# Altium project new edr.PrjPcb
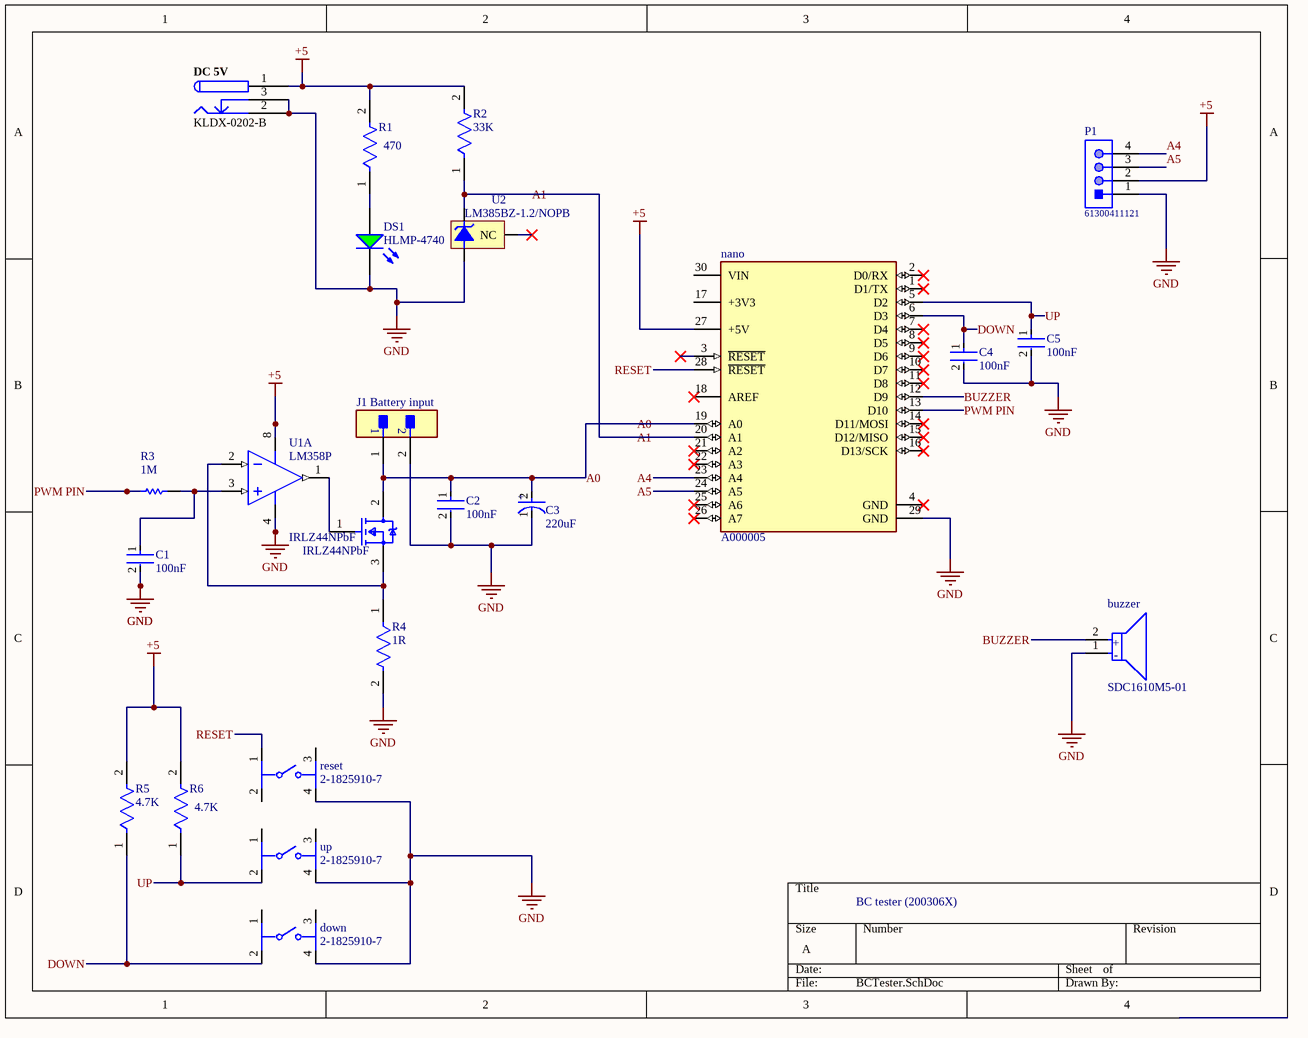
[diagram p0: BCTester.SchDoc]
1 sheet, 23 parts. Net scope: global (net labels, ports and power ports of the same name join across sheets).
Board file: PCB1.PcbDoc

## Sheet BCTester.SchDoc
size A; SheetNumber: 1; SheetTotal: 1; SPICEModelCacheEEAPYXYC: <root> / <DocumentId>EEAPYXYC</DocumentId> / </root>

### Parts
buzzer  SDC1610M5-01  [FP-SDC1610M5-01-MFG]
C1  100nF  [FP-DE6_D7_T7_F7_5_d0_6-0-MFG]
C2  100nF  [FP-DE6_D7_T7_F7_5_d0_6-0-MFG]
C3  220uF  [FP-RAD-TH-D_8_0_5-L_11_5-MFG]
C4  100nF  [FP-DE6_D7_T7_F7_5_d0_6-0-MFG]
C5  100nF  [FP-DE6_D7_T7_F7_5_d0_6-0-MFG]
DC_5V  KLDX-0202-B  [KYCN-KLDX-0202-B_V]
down  2-1825910-7  [FP-2-1825910-7-MFG]
DS1  HLMP-4740  [AVAG-HLMP-4740]
IRLZ44NPbF  IRLZ44NPbF  [FP-PG-TO220-3-MFG]
J1  Battery input  [FP-M20-9990246-MFG]
nano  A000005  [FP-A000005-MFG]
P1  61300411121  [61300411121]
R1  470  [FP-RNC55-MFG]
R2  33K  [FP-H8511KBYA-MFG]
R3  1M  [RESA60-630X240]
R4  1R  [FP-PR01-MFG]
R5  4.7K  [FP-MRS25-MFG]
R6  4.7K  [FP-MRS25-MFG]
reset  2-1825910-7  [FP-2-1825910-7-MFG]
U1  LM358P  [P0008A]  (part A of 2)
U2  LM385BZ-1.2/NOPB  [Z03A]
up  2-1825910-7  [FP-2-1825910-7-MFG]

### Nets
+5: DC_5V.1 nano.27(+5V) P1.2 R1.2 R2.2 R5.2 R6.2 U1.8(VCC)
GND: buzzer.1(C) C1.2 C2.2 C3.1(C) C4.2 C5.2 DC_5V.2 DC_5V.3 down.4 DS1.2(K) J1.2 nano.29(GND) P1.1 R4.2 reset.4 U1.4(GND) U2.3(-V) up.4
A0: C2.1 C3.2(A) IRLZ44NPbF.2(D) J1.1 nano.19(A0)
A1: nano.20(A1) R2.1 U2.2(+V)
A4: nano.23(A4) P1.4
A5: nano.24(A5) P1.3
BUZZER: buzzer.2(A) nano.12(D9)
DOWN: C4.1 down.2 nano.6(D3) R5.1
PWM PIN: nano.13(D10) R3.1
RESET: nano.28(~{RESET}) reset.1
UP: C5.1 nano.5(D2) R6.1 up.2
NetC1_1: C1.1 R3.2 U1.3(1IN+)
NetDS1_1: DS1.1(A) R1.1
NetIRLZ44NPbF_1: IRLZ44NPbF.1(G) U1.1(1OUT)
NetIRLZ44NPbF_3: IRLZ44NPbF.3(S) R4.1 U1.2(1IN-)

Not connected (* = marked no-connect by the designer): down 1 3; nano 1(D1/TX)* 2(D0/RX)* 3(~{RESET})* 4(GND)* 7(D4)* 8(D5)* 9(D6)* 10(D7)* 11(D8)* 14(D11/MOSI)* 15(D12/MISO)* 16(D13/SCK)* 17(+3V3) 18(AREF)* 21(A2)* 22(A3)* 25(A6)* 26(A7)* 30(VIN); reset 2 3; U2 1(NC)*; up 1 3

### Notes on the sheet
- BC tester (200306X)
- (in symbol CMP-05427-001200-1) +
- (in symbol CMP-08413-000008-1) +; -

### Library data of the parts
buzzer = CMP-08413-000008-1: AUDIO MAGNETIC INDICATOR 4-8V TH; Nominal Supply Voltage (DC): 5V; Input Type: DC; Max Supply Current: 30mA; Number of Terminals/Pins: 2; Frequency: 2.4kHz; Lead Free: Lead Free; Operating Supply Current: 30mA; Sensing Method: Magnetic; Termination: PC Pins; Number of Pins: 2; Mount: Through Hole; Min Operating Temperature: -10°C; Diameter: 16mm; Series: SDC; Max Operating Temperature: 70°C; Packaging: Tray; Voltage Rating: 5V; Height: 10mm
C1 C2 C4 C5 = CMP-06035-062244-1: CAP CER 1000PF 300VAC RADIAL; Lead/Base Style: Formed Leads; Capacitance: 1nF; Material: Ceramic; Tolerance: 20%; Lead Diameter: 0.6mm; Voltage Rating (AC): 300V; Termination: Radial; RoHS Compliant: Yes; Width: 7mm; Package Quantity: 700; Lead Pitch: 7.5mm; Case/Package: Radial; Resistor Type: Ceramic; Ratings: AEC-Q200; Series: KJ; Depth: 7mm; Min Operating Temperature: -25°C; Height - Seated (Max): 0.394inch; Mount: Through Hole; REACH SVHC: No SVHC; Max Operating Temperature: 125°C; Packaging: Bulk
C3 = CMP-05427-001200-1: Aluminum Electrolytic Capacitors (Radial Lead Type) AEC-Q200 Qualified 220uF ±20% 25V; Ripple Current (AC): 230mA; Polarity: Polar; Lead Diameter: 0.6mm; Lead/Base Style: Straight; Life (Hours): 1000Hour; Voltage Rating (DC): 25V; Max Operating Temperature: 105°C; Case/Package: Radial; Termination: Radial; Package Quantity: 200; Voltage: 25V; Height: 11.5mm; Capacitance: 220uF; Ripple Current: 230mA; Tolerance: 20%; Mount: Through Hole; Construction: RADIAL; Diameter: 8mm; RoHS Compliant: Yes; Voltage Rating: 25V; Lead Pitch: 3.5mm; Contact Plating: Tin; Height - Seated (Max): 0.512inch; Series: HD; Min Operating Temperature: -55°C; Number of Pins: 2; REACH SVHC: No SVHC; Packaging: Bulk; Length: 11.5mm
DC_5V = CMP-0256-00001-1: 3 Conductor Power Jack, 2 break 2 aux contacts; ComponentLink2URL: http://anacapa.kycon.com/Catalog_PDF/KLDX_0202.pdf; PackageReference: KLDX-0202-B; Contact Finish: Brass; ComponentLink2Description: Datasheet; Mounting Technology: Through Hole; PackageDescription: Jack, 9 x 14.5 mm Body, 2.5 mm Center Pin Diameter; ComponentLink1Description: Manufacturer URL; PartNumber: KLDX-0202-B; ComponentLink1URL: http://kycon.com/
down reset up = CMP-03402-000004-1: SWITCH TACTILE SPST-NO 0.05A 24V; Manufacturer: TE Connectivity; Contact Current Rating: 50mA; Operating Force: 160gf; Electromechanical Life: 100000Cycles; Contact Resistance: 100mΩ; ComponentLink2Description: Datasheet; Height: 13.3mm; Digikey Description: SWITCH TACTILE SPST-NO 0.05A 24V; Device Class L2: Switches; Category: Switch; Device Class L3: Pushbutton Switches; Manufacturer Part Number: 2-1825910-7; Device Class L1: Electromechanical; Mount: Through Hole; Temperature Range High: +85°C; ComponentLink2URL: https://www.te.com/commerce/DocumentDelivery/DDEController?Action=showdoc&DocId=Customer+Drawing%7F1825910%7FC10%7Fpdf%7FEnglish%7FENG_CD_1825910_C10.pdf%7F2-1825910-7; RoHS: TRUE; Temperature: -35°C to +85°C; Mouser Description: Switch Tactile OFF (ON) SPST Extended Round Button PC Pins 0.05A 24VDC 100000Cycles 1.57N Thru-Hole Loose; Automotive: No; Voltage Rating Dc: 24V; Package: 2-1825910-7; Lead Free: Yes; Octopart: https://octopart.com/2-1825910-7-te+connectivity-42270510; Temperature Range Low: -35°C; Throw Configuration: SPST-NO
DS1 = CMP-2000-06413-1: T-1 3/4 (5 mm) Low Current LED Lamp, Green, 1.9 V, -20 to 100 degC, 2-Pin THD, RoHS, Bulk; Manufacturer: AvagoTechnologies; Type: Uni-Color; Peak Wavelength: 565nm; Rad Hard: No; Viewing Angle: 50°; Dominant Wavelength/Color Temperature: 569nm; Number of LEDs: 1; Lens Appearance: ColoredDiffused; Lens Shape Type: Circular; Mounting Orientation: TopMount; Intensity: 2.3mcd; Datasheet Version: 07/2014; Category: LEDs; Datasheet URL: http://docs.avagotech.com/docs/AV02-1557EN; Packaging: Bulk; Pin Count: 2; Mounting Technology: ThroughHole; Package Reference: HLMP-4740; Mounting: ThroughHole; Manufacturer URL: http://www.avagotech.com/; Color: Green; Package: 2T-13/4; Package Description: 2-Pin Through Hole Device, Dia 5.845 mm, Pitch 2.54 mm; ComponentLink1Description: New link; ComponentLink1URL: *
IRLZ44NPbF = CMP-32901-000488-1: MOSFET N-CH 55V 47A TO220AB; Turn-On Delay Time: 11ns; Gate to Source Voltage (Vgs): 16V; Element Configuration: Single; Rds On Max: 22mR; Turn-Off Delay Time: 26ns; Max Power Dissipation: 110W; Threshold Voltage: 2V; Drain to Source Resistance: 35mR; Input Capacitance: 1.7nF; Continuous Drain Current (ID): 47A; Case/Package: TO-220; Lead Free: Lead Free; Halogen Free: Halogen Free; Packaging: Rail/Tube; Length: 0.414inch; Min Operating Temperature: -55°C; REACH SVHC: No SVHC; Number of Pins: 3; Width: 0.185inch; Drain to Source Voltage (Vdss): 55V; Power Dissipation: 110W; RoHS Compliant: Yes; Max Operating Temperature: 175°C; Height: 0.6inch; Max Dual Supply Voltage: 55V; Drain to Source Breakdown Voltage: 55V; Mount: Through Hole
J1 = CMP-15831-000009-1: CONN HEADER VERT 2POS 2.54MM; Manufacturer: Harwin; Manufacturer Part Number: M20-9990246; Conn Gender: Male; Conn Orientation: Vertical; Number Of Contacts: 2; Current Rating: 3A; ComponentLink2URL: https://cdn.harwin.com/pdfs/M20-999.pdf; ComponentLink2Description: Datasheet; Package: M20-9990246; Temperature: -40°C to +105°C; Octopart: https://octopart.com/m20-9990246-harwin-2590635; Mouser Description: 2.54mm (0.1") Pitch SIL Vertical PC Tail Pin Header, 6.1mm mating pin height, tin, 2 contacts; Temperature Range High: +105°C; Device Class L1: Connectors; RoHS: TRUE; Automotive: No; Height: 8.99mm; Number Of Rows: 1; Contact Material: Tin,Nickel; Category: Conn; Pitch: 2.54mm; Lead Free: Yes; Digikey Description: CONN HEADER VERT 2POS 2.54MM; Temperature Range Low: -40°C; Device Class L3: unset; Device Class L2: Headers and Wire Housings
nano = CMP-189986-000002-1: ARDUINO NANO ATMEGA328 EVAL BRD; Number of Bits: 8; Evaluation Kit: Yes; Operating Supply Voltage: 12V; Interface: I2C; Data Bus Width: 8b; Core Architecture: AVR; Packaging: Bulk; Length: 7inch; Package Quantity: 50; Width: 5inch; REACH SVHC: No SVHC; Weight: 0.358383oz; Series: AVR® ATmega; Height: 0.25inch
P1 = CMP-1502-01064-1: THT Vertical Pin Header WR-PHD, Pitch 2.54 mm, Single Row, 4 pins; Manufacturer: Wurth Elektronik; Withstanding Voltage: 500VAC; Rated Current: 3A; Working Voltage: 250VAC; Pin Number: 4; Gender: Male; Contact Resistance: 20mOhm; Pitch: 2.54mm; Manufacturer URL: http://www.we-online.de; Operating Temperature: -40to105degC; Packaging: Bag; Mounting Technology: THT; Package Reference: 61300411121; Datasheet URL: https://katalog.we-online.de/em/datasheet/6130xx11121.pdf; Publisher: WurthElektronik; Part Number: 61300411121; Row Number: Single; Orientation: Vertical
R1 = CMP-02408-000004-1: RES 10K OHM 1/8W 1% AXIAL; Manufacturer Part Number: RNC55H1002FSB14; Manufacturer: Vishay; Voltage Rating: 200V; Power Rating: 0.125W; Resistance: 10kΩ; Temperature Coefficient: 50ppm/°C; Value: 10kΩ; Automotive: No; Category: Res; Tolerance: 1%; Temperature: -65°C to +175°C; Device Class L2: Resistors; Composition: Metal Film; Height: 2.69mm; Failure Rate: 0.001%; ComponentLink2URL: https://www.vishay.com/docs/31025/erc.pdf; Temperature Range High: +175°C; Lead Free: No; Series: RNC; Device Class L1: Passive Components; Ipc Land Pattern Name: RESAD1100W85L762D269; Octopart: https://octopart.com/rnc55h1002fs-vishay-40848808; Package: RNC55; RoHS: FALSE; Military Standard: true; Device Class L3: Through-Hole Resistors; ComponentLink2Description: Datasheet; Digikey Description: RES 10K OHM 1/8W 1% AXIAL; Temperature Range Low: -65°C
R2 = CMP-03212-000010-1: RES 511K OHM 0.1% 1/4W AXIAL; Max Power Dissipation: 250mW; Temperature Coefficient: 15ppm/°C; Voltage Rating: 350V; Number of Resistors: 1; Resistance: 511kR; Lead Diameter: 0.6mm; Lead Length: 30mm; Resistor Type: Thin Film; Termination: Axial; Technology: METAL FILM; ELV: Compliant; Number of Terminations: 2; Case/Package: Axial; Lead/Base Style: Axial; RoHS Compliant: Yes; Max Operating Temperature: 155°C; Package Quantity: 250; Series: Holco, Holsworthy; Weight: 0.008466oz; Packaging: Bulk; Length: 7.2mm; Diameter: 2.5mm; REACH SVHC: No SVHC; Resistance Tolerance: 0.1%; Tolerance: 0.1%; Power Rating: 250mW; Mount: Axial; Min Operating Temperature: -55°C; Voltage Rating (DC): 350V
R3 = CMP-1659-00070-1: Axial Resistor, 1 MOhm, +/- 1%, 250 mW, -55 to 155 degC, 2-Pin THD, RoHS, Bulk; Power Rating: 250 mW; Resistance: 47.5 kohm; Voltage Rating: 250 V; ComponentLink1Description: Manufacturer URL; PackageReference: MFR-25; ComponentLink2Description: Datasheet; ComponentLink2URL: http://www.yageo.com/documents/recent/Yageo%20LR_MFR_2013.pdf; Tolerance: 1%; DatasheetVersion: Apr-13; Package Quantity: 200; Packaging: Bulk; Case\Package: Axial; RoHSCompliant: true; ComponentLink1URL: http://www.yageo.com/; Length: 0.248 inch; Min Operating Temperature: -55 degC; Mount: Through Hole; PackageDescription: 2-Pin Axial Lead, Dia 2.4 mm, Body Length 6.3 mm; Max Operating Temperature: 155 degC
R4 = CMP-02408-000029-1: RES 75K OHM 1W 5% AXIAL; Lead Diameter: 0.58mm; Voltage Rating: 350V; Resistance: 75kR; Temperature Coefficient: 250ppm/°C; Max Power Dissipation: 1W; Resistance Tolerance: 5%; RoHS Compliant: Yes; Power Rating: 1W; Packaging: Tape and Reel; Package Quantity: 5000; Width: 2.5mm; Number of Pins: 2; Operating Supply Voltage: 350V; Resistor Type: Metal Film; Technology: METAL FILM; Max Operating Temperature: 155°C; Termination: Axial; Lead Free: Lead Free; Voltage Rating (DC): 350V; Series: PR01; Diameter: 2.5mm; Min Operating Temperature: -55°C; Case/Package: Axial; Number of Terminations: 2; Features: Flame Retardant Coating; Length: 0.256inch; Tolerance: 5%
R5 R6 = CMP-02408-000051-1: RES 1K OHM 0.6W 1% AXIAL; Power Rating: 600mW; Lead Diameter: 0.6mm; Voltage Rating (DC): 350V; Resistance: 1kR; Temperature Coefficient: 50ppm/°C; Width: 2.5mm; Military Standard: Not; Package Quantity: 5000; Radiation Hardening: No; Case/Package: Axial; Resistance Tolerance: 1%; Resistor Type: Metal Film; Contact Plating: Tin; Length: 6.5mm; Lead Free: Lead Free; RoHS Compliant: Yes; Mount: Through Hole; Number of Pins: 2; Technology: THIN FILM; Voltage Rating: 350V; Min Operating Temperature: -55°C; Weight: 0.00776oz; Diameter: 2.5mm; Construction: Cylindrical; Series: MRS25; Tolerance: 1%; Packaging: Tape and Reel; Max Operating Temperature: 155°C; Max Power Dissipation: 600mW; Number of Terminations: 2; Termination: Axial
U1 = CMP-2000-06549-1: Dual Operational Amplifier, 3 to 32 V, 0 to 70 degC, 8-Pin PDIP (P), RoHS, Tape and Reel; Manufacturer: Technik Industrial; Datasheet Version: Rev. T, 04/2015; Datasheet URL: http://www.ti.com/lit/ds/symlink/lm358.pdf; Manufacturer URL: http://www.technik.com.hk/; Package Description: 8-Pin Double In-line Package, Body 9.59 x 6.35 mm, Pitch 2.54 mm; Mounting Technology: ThroughHole; Package URL: http://www.ti.com/lit/ml/mpdi001b/mpdi001b.pdf; Package Reference: P8
U2 = CMP-0074-00028-2: Micropower Voltage Reference Diode, 3-pin TO-92, Pb-Free; Manufacturer: National Semiconductor; PackageTopMarking: NSXYTT*LM385*BZ1.2; CompType: Voltage Reference IC; PowerWise: N; Code_JEDEC: TO-226-AA; DatasheetVersion: Jan-2008; ComponentLink2Description: LM385-1.2 Web Page; ComponentLink3Description: Z03A Package Page; RoHS: Y; ComponentLink2URL: http://www.national.com/pf/LM/LM385-1.2.html; ComponentLink3URL: http://www.national.com/packaging/folders/z03a.html; RevisionNote: Component URLs added; ComponentLink1URL: http://www.national.com/ds/LM/LM385-1.2.pdf; PackageReference: Z03A; ComponentLink1Description: LM385-1.2 Datasheet; PinCount: 3; PackageVersion: revG, Sep-2000; PackageDescription: TO-92, Molded, 3 Lead